# Altium schematic sheet BufferBias.SchDoc
size A
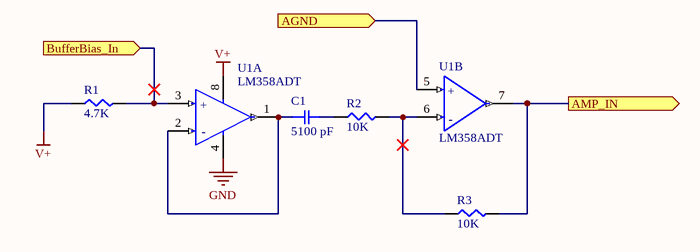
[diagram p0: BufferBias.SchDoc]

## Parts
C1  5100 pF  [SMD-0805C]
R1  4.7K  [SMD-0805-RES]
R2  10K  [SMD-0805-RES]
R3  10K  [SMD-0805-RES]
U1  LM358ADT  [FP-SO8-IPC_C]  (parts A,B of 2)

## Ports
AGND (in), AMP_IN (out), BufferBias_In (in)

## Nets
GND: U1.4(VCC-)
V+: R1.1 U1.8(VCC+)
AGND: U1.5(In2+) ; port AGND
AMP_IN: R3.2 U1.7(Out2) ; port AMP_IN
BufferBias_In: R1.2 U1.3(In1+) ; port BufferBias_In
NetC1_1: C1.1 U1.1(Out1) U1.2(In1-)
NetC1_2: C1.2 R2.1
NetR2_2: R2.2 R3.1 U1.6(In2-)

## Notes on the sheet
- (in symbol CMP-12131-000002-1, part A) +; -
- (in symbol CMP-12131-000002-1, part B) +; -

## Library data of the parts
C1 = GRM2195C1H512JA01D: Manufacturer: KEMET; Manufacturer Part Number: C0805C512F4HACAUTO; Value: 5100pF; Descriptions: 5100 pF ±1% 16V Ceramic Capacitor X8R 0805 (2012 Metric); Datasheet Link: https://content.kemet.com/datasheets/KEM_C1007_X8R_ULTRA_150C_SMD.pdf; Operating Temperature: -55°C ~ 125°C; Package / Case: 0805 (2012 Metric)
R1 = ERJ-6ENF4701V: Manufacturer: Stackpole Electronics Inc; Manufacturer Part Number: RNCF0805DTE4K70; Descriptions: RES 4.7K OHM 0.5% 1/8W 0805; Datasheet Link: https://www.seielect.com/catalog/sei-rncf.pdf; Value: 4.7k; Operating Temperature: -55°C ~ 155°C; Package / Case: 0805 (2012 Metric)
R2 R3 = ERJ-6ENF1002V: Manufacturer: Stackpole Electronics Inc; Manufacturer Part Number: RMCF0805JG10K0; Descriptions: 10 kOhms ±5% 0.125W, 1/8W Chip Resistor 0805 (2012 Metric) Automotive AEC-Q200 Thick Film; Datasheet Link: https://www.seielect.com/catalog/sei-rmcf_rmcp.pdf; Value: 10k; Operating Temperature: -55°C ~ 155°C; Package / Case: 0805 (2012 Metric)
U1 = CMP-12131-000002-1: Manufacturer Part Number: LM358WDT; Manufacturer: STMicroelectronics; Descriptions: General Purpose Amplifier 2 Circuit - 8-SOIC; RoHS: TRUE; Value: N/A; Operating Temperature: 0°C ~ 70°C; Datasheet Link: https://www.st.com/content/ccc/resource/technical/document/datasheet/82/55/37/12/85/cc/4c/29/CD00003160.pdf/files/CD00003160.pdf/jcr:content/translations/en.CD00003160.pdf; Package / Case: 8-SOIC